# EasyEDA Pro project ProPrj_H750VB_2024-10-16.epro, board PCB2
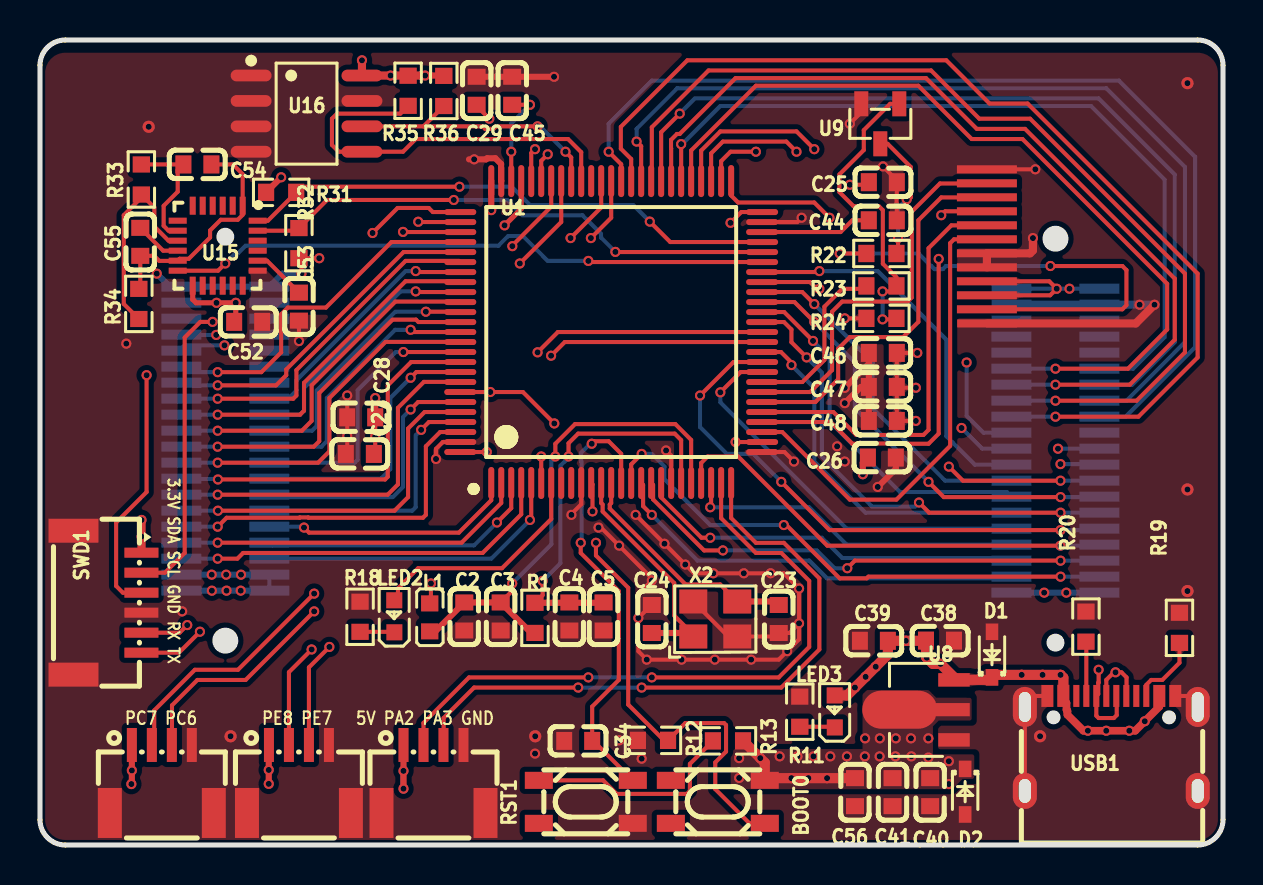
[diagram p4: board, top side]
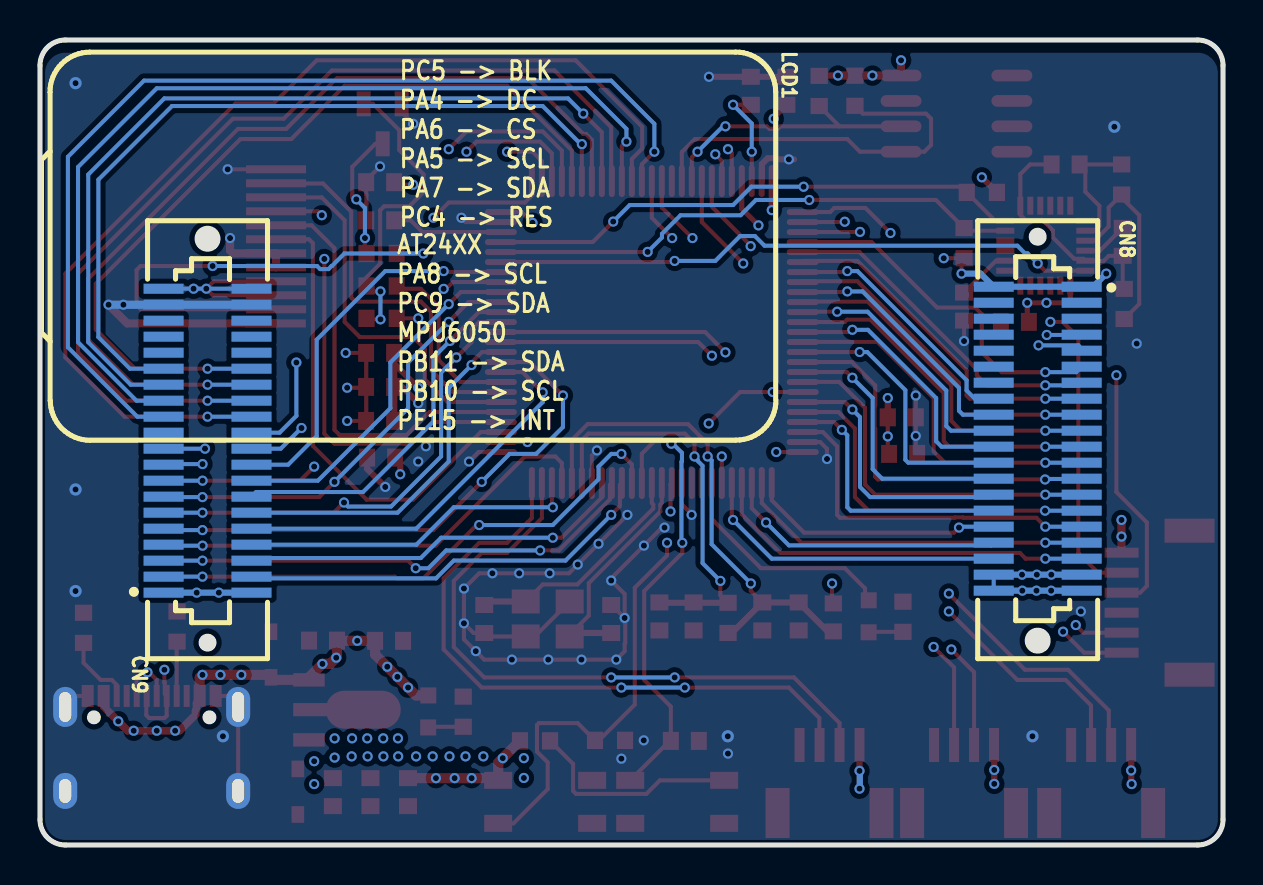
[diagram p5: board, bottom side, seen from below]

Outline 59.18 x 40.26 mm; copper layers: Top Layer, Inner1, 电源, Bottom Layer. Coordinates in mm from the lower left corner of the outline.
Outline path: 0,38.99 0,1.27 arc(0.37,0.37) 1.27,0 57.91,0 arc(58.81,0.37) 59.18,1.27 59.18,38.99 arc(58.81,39.89) 57.91,40.26 1.27,40.26 arc(0.37,39.89) 0,38.99
Stack: Top Layer 0.035mm 外层铜厚1oz / Dielectric1 0.2104mm 7628 RC49% 8.6mil / Inner1 0.0152mm 内层铜厚 / Dielectric2 1.065mm 1.1mm H/HOZ Copper / 电源 0.0152mm 内层铜厚 / Dielectric3 0.2104mm 7628 RC49% 8.6mil / Bottom Layer 0.035mm 外层铜厚1oz

## Design rules (mm)
net CAN_TX: OSC_OUT
net CAN_RX: OSC_OUT
template: 自定义配置
spacing copperThickness1oz (default): track to track 0.102, other pairs 0.152 to 0.3
spacing copperThickness2oz: track to track 0.203, other pairs 0.152 to 0.3
track width copperThickness1oz (default): min 0.127, default 0.254, max 2.54
track width copperThickness2oz: min 0.203, default 0.254, max 2.54
differential pair differentialPair (default): width min 0.127, default 0.254, max 2.54; gap min 0.152, default 0.152
via viaSize (default): diameter min 0.5, default 0.61, max 10; hole min 0.3, default 0.305, max 6.3
net 3.3V uses copperRegion1
net GND uses copperRegion1

## Placement (name value [footprint] x y rotation side)
BOOT0  TS-1145A-B-A  [SW-SMD_4P-L4.2-W3.2-P2.15-LS5.2]  33.91 2.16 90 top
C2  100nF  [C0603]  21.23 11.43 90 top
C3  100nF  [C0603]  23.05 11.43 90 top
C4  100nF  [C0603]  26.48 11.43 90 top
C5  100nF  [C0603]  28.19 11.43 90 top
C23  22pf  [C0603]  36.96 11.3 90 top
C24  22pf  [C0603]  30.61 11.3 270 top
C25  100nF  [C0603]  42.16 33.15 180 top
C26  100nF  [C0603]  42.12 19.38 180 top
C27  100nF  [C0603]  16 19.56 0 top
C28  100nF  [C0603]  16.07 21.39 0 top
C29  4.7uF  [C0603]  21.84 37.72 270 top
C34  100nF  [C0603]  26.92 5.21 0 top
C38  100nF  [C0603]  45.02 10.22 180 top
C39  100nF  [C0603]  41.72 10.21 0 top
C40  100nF  [C0603]  44.53 2.64 90 top
C41  10uF  [C0603]  42.65 2.64 90 top
C44  2.2uF  [C0603]  42.16 31.24 180 top
C45  2.2uF  [C0603]  23.62 37.72 270 top
C46  100nF  [C0603]  42.16 24.61 0 top
C47  100nF  [C0603]  42.16 22.91 0 top
C48  100nF  [C0603]  42.16 21.21 0 top
C52  100nF  [C0603]  10.41 26.16 180 top
C53  2.2nF  [C0603]  12.95 26.92 270 top
C54  100nF  [C0603]  7.87 34.04 0 top
C55  100nF  [C0603]  5.02 30.16 90 top
C56  100nF  [C0603]  40.77 2.64 90 top
CN8  X0802WVS-40AS-LPV01  [CONN-SMD_40P-P0.80_XKB_X0802WVS-40ADS-LPV01]  9.27 20.32 270 bottom
CN9  X0802WVS-40AS-LPV01  [CONN-SMD_40P-P0.80_XKB_X0802WVS-40ADS-LPV01]  50.8 20.22 90 bottom
D1  CESD5V0D3  [SOD-323_L1.7-W1.3-LS2.6-RD-2]  47.62 9.53 90 top
D2  CESD5V0D3  [SOD-323_L1.7-W1.3-LS2.6-RD-2]  46.28 2.67 270 top
L1  BLM18SG331TN1D-300Ω100MHz  [L0603]  19.5 11.38 270 top
LCD1  1.47寸 IPS 172*320  [1.47LCD-IPS-172*320-反面]  47.12 29.97 270 bottom
LED2  -  [LED_0603]  17.72 11.49 90 top
LED3  -  [LED_0603]  39.75 6.73 90 top
R1  0  [R0603]  24.76 11.36 270 top
R11  10K  [R0603]  38.01 6.67 270 top
R12  10K  [R0603]  30.67 5.23 0 top
R13  10K  [R0603]  34.42 5.21 0 top
R18  10K  [R0603]  16.01 11.41 270 top
R19  5.1k  [R0603]  57 10.86 90 top
R20  5.1k  [R0603]  52.32 10.92 270 top
R22  20  [R0603]  42.09 29.58 180 top
R23  1K  [R0603]  42.09 27.96 0 top
R24  10K  [R0603]  42.09 26.34 0 top
R31  5.1k  [R0603]  12.06 32.64 180 top
R32  5.1k  [R0603]  12.95 30.1 270 top
R33  5.1k  [R0603]  5.07 33.28 90 top
R34  5.1k  [R0603]  4.94 27.06 90 top
R35  5.1k  [R0603]  18.41 37.72 270 top
R36  5.1k  [R0603]  20.2 37.71 270 top
RST1  TS-1145A-B-A  [SW-SMD_4P-L4.2-W3.2-P2.15-LS5.2]  27.31 2.16 90 top
SWD1  swd  [CONN-SMD_6P-P1.00_MEGASTAR_ZX-SH1.0-6PWT]  3.38 12.12 270 top
U1  STM32H750VBT6  [LQFP-100_L14.0-W14.0-P0.50-LS16.0-BL]  28.57 25.65 0 top
U8  AMS1117-3.3  [SOT-89_L4.5-W2.5-P1.50-LS4.2-BR]  44.37 6.76 0 top
U9  SS8050  [SOT-23-3_L2.9-W1.3-P1.90-LS2.4-BR]  42.04 36.07 90 top
U15  MPU6050  [QFN-24_L4.0-W4.0-P0.50-BL]  8.89 29.97 180 top
U16  AT24C256C-SSHL-T  [SOIC-8_L4.9-W3.9-P1.27-LS6.0-BL]  13.34 36.58 270 top
USART2  WAFER-SH1.0-4PWB  [CONN-SMD_4P-P1.00_WAFER-SH1.0-4PWB]  19.69 3.3 0 top
USART3  WAFER-SH1.0-4PWB  [CONN-SMD_4P-P1.00_WAFER-SH1.0-4PWB]  12.95 3.3 0 top
USART7  WAFER-SH1.0-4PWB  [CONN-SMD_4P-P1.00_WAFER-SH1.0-4PWB]  6.1 3.3 0 top
USB1  TYPE-C 16PIN 2MD(073)  [USB-C-SMD_TYPE-C-6PIN-2MD-073]  53.59 5.08 0 top
X2  25MHz  [OSC-SMD_4P-L3.2-W2.5-BL]  33.78 11.3 0 top

## Footprints (pads in the part's own frame, mm; a bottom-side part is the same pattern mirrored in y, then rotated)
1.47LCD-IPS-172*320-反面
  rect 0.4x3 smd far side: 1(3.888,-0.266) 2(3.181,-0.254) 3(2.481,-0.254) 4(1.781,-0.254) 5(1.081,-0.254) 6(0.381,-0.254) 7(-0.319,-0.254) 8(-1.019,-0.254) 9(-1.719,-0.254) 10(-2.419,-0.254) 11(-3.119,-0.254) 12(-3.819,-0.254)
C0603
  rect 0.8x0.9 smd: 1(-0.7,0) 2(0.7,0)
CONN-SMD_4P-P1.00_WAFER-SH1.0-4PWB
  rect 0.5x1.7 smd: 1(-1.5,1.7) 2(-0.5,1.7) 3(0.5,1.7) 4(1.5,1.7)
  rect 1.2x2.5 smd: 5(-2.6,-1.7) 6(2.6,-1.7)
CONN-SMD_6P-P1.00_MEGASTAR_ZX-SH1.0-6PWT
  rect 0.5x1.7 smd: 1(-2.5,1.7) 2(-1.5,1.7) 3(-0.5,1.7) 4(0.5,1.7) 5(1.5,1.7) 6(2.5,1.7)
  rect 1.2x2.5 smd: 7(3.6,-1.7) 8(-3.6,-1.7)
CONN-SMD_40P-P0.80_XKB_X0802WVS-40ADS-LPV01
  rect 0.5x2 smd: 1(-7.6,2.2) 2(-7.6,-2.2) 3(-6.8,2.2) 4(-6.8,-2.2) 5(-6,2.2) 6(-6,-2.2) 7(-5.2,2.2) 8(-5.2,-2.2) 9(-4.4,2.2) 10(-4.4,-2.2) 11(-3.6,2.2) 12(-3.6,-2.2) 13(-2.8,2.2) 14(-2.8,-2.2) 15(-2,2.2) 16(-2,-2.2) 17(-1.2,2.2) 18(-1.2,-2.2) 19(-0.4,2.2) 20(-0.4,-2.2) 21(0.4,2.2) 22(0.4,-2.2) 23(1.2,2.2) 24(1.2,-2.2) 25(2,2.2) 26(2,-2.2) 27(2.8,2.2) 28(2.8,-2.2) 29(3.6,2.2) 30(3.6,-2.2) 31(4.4,2.2) 32(4.4,-2.2) 33(5.2,2.2) 34(5.2,-2.2) 35(6,2.2) 36(6,-2.2) 37(6.8,2.2) 38(6.8,-2.2) 39(7.6,2.2) 40(7.6,-2.2)
L0603
  rect 0.8x0.864 smd: 1(-0.7,0) 2(0.7,0)
LED_0603
  rect 0.8x0.8 smd: 1(-0.851,-0.01) 2(0.75,-0.005)
LQFP-100_L14.0-W14.0-P0.50-LS16.0-BL
  oval 0.3x1.6 smd: 1(-6,-7.55) 2(-5.5,-7.55) 3(-5,-7.55) 4(-4.5,-7.55) 5(-4,-7.55) 6(-3.5,-7.55) 7(-3,-7.55) 8(-2.5,-7.55) 9(-2,-7.55) 10(-1.5,-7.55) 11(-1,-7.55) 12(-0.5,-7.55) 13(0,-7.55) 14(0.5,-7.55) 15(1,-7.55) 16(1.5,-7.55) 17(2,-7.55) 18(2.5,-7.55) 19(3,-7.55) 20(3.5,-7.55) 21(4,-7.55) 22(4.5,-7.55) 23(5,-7.55) 24(5.5,-7.55) 25(6,-7.55) 51(6,7.55) 52(5.5,7.55) 53(5,7.55) 54(4.5,7.55) 55(4,7.55) 56(3.5,7.55) 57(3,7.55) 58(2.5,7.55) 59(2,7.55) 60(1.5,7.55) 61(1,7.55) 62(0.5,7.55) 63(0,7.55) 64(-0.5,7.55) 65(-1,7.55) 66(-1.5,7.55) 67(-2,7.55) 68(-2.5,7.55) 69(-3,7.55) 70(-3.5,7.55) 71(-4,7.55) 72(-4.5,7.55) 73(-5,7.55) 74(-5.5,7.55) 75(-6,7.55)
  oval 1.6x0.3 smd: 26(7.55,-6) 27(7.55,-5.5) 28(7.55,-5) 29(7.55,-4.5) 30(7.55,-4) 31(7.55,-3.5) 32(7.55,-3) 33(7.55,-2.5) 34(7.55,-2) 35(7.55,-1.5) 36(7.55,-1) 37(7.55,-0.5) 38(7.55,0) 39(7.55,0.5) 40(7.55,1) 41(7.55,1.5) 42(7.55,2) 43(7.55,2.5) 44(7.55,3) 45(7.55,3.5) 46(7.55,4) 47(7.55,4.5) 48(7.55,5) 49(7.55,5.5) 50(7.55,6) 76(-7.55,6) 77(-7.55,5.5) 78(-7.55,5) 79(-7.55,4.5) 80(-7.55,4) 81(-7.55,3.5) 82(-7.55,3) 83(-7.55,2.5) 84(-7.55,2) 85(-7.55,1.5) 86(-7.55,1) 87(-7.55,0.5) 88(-7.55,0) 89(-7.55,-0.5) 90(-7.55,-1) 91(-7.55,-1.5) 92(-7.55,-2) 93(-7.55,-2.5) 94(-7.55,-3) 95(-7.55,-3.5) 96(-7.55,-4) 97(-7.55,-4.5) 98(-7.55,-5) 99(-7.55,-5.5) 100(-7.55,-6)
OSC-SMD_4P-L3.2-W2.5-BL
  rect 1.4x1.2 smd: 1(-1.1,-0.875) 2(1.1,-0.875) 3(1.1,0.875) 4(-1.1,0.875)
QFN-24_L4.0-W4.0-P0.50-BL
  rect 0.3x0.9 smd: 1(-1.25,-2) 2(-0.75,-2) 3(-0.25,-2) 4(0.25,-2) 5(0.75,-2) 6(1.25,-2) 13(1.25,2) 14(0.75,2) 15(0.25,2) 16(-0.25,2) 17(-0.75,2) 18(-1.25,2)
  rect 0.9x0.3 smd: 7(2,-1.25) 8(2,-0.75) 9(2,-0.25) 10(2,0.25) 11(2,0.75) 12(2,1.25) 19(-2,1.25) 20(-2,0.75) 21(-2,0.25) 22(-2,-0.25) 23(-2,-0.75) 24(-2,-1.25)
R0603
  rect 0.806x0.864 smd: 1(-0.753,0) 2(0.753,0)
SOD-323_L1.7-W1.3-LS2.6-RD-2
  rect 0.83x0.63 smd: 1(-1.14,0) 2(1.14,0)
SOIC-8_L4.9-W3.9-P1.27-LS6.0-BL
  oval 0.588x2.045 smd: 1(-1.905,-2.772) 2(-0.635,-2.772) 3(0.635,-2.772) 4(1.905,-2.772) 5(1.905,2.772) 6(0.635,2.772) 7(-0.635,2.772) 8(-1.905,2.772)
SOT-23-3_L2.9-W1.3-P1.90-LS2.4-BR
  rect 1.25x0.7 smd: 1(1,-0.95) 2(1,0.95) 3(-1,0)
SOT-89_L4.5-W2.5-P1.50-LS4.2-BR
  rect 1.575x0.672 smd: 1(1.356,-1.5) 3(1.356,1.5)
  custom 5.377x1.9 smd: 2(-1.356,0.009)
SW-SMD_4P-L4.2-W3.2-P2.15-LS5.2
  rect 0.85x1.4 smd: 1(1.075,2.35) 2(1.075,-2.35) 3(-1.075,2.35) 4(-1.075,-2.35)
USB-C-SMD_TYPE-C-6PIN-2MD-073
  rect 0.6x1.1 smd: 1(-3.2,2.375) 2(-2.4,2.375) 11(2.4,2.375) 12(3.2,2.375)
  rect 0.3x1.1 smd: 3(-1.75,2.375) 4(-1.25,2.375) 5(-0.75,2.375) 6(-0.25,2.375) 7(0.25,2.375) 8(0.75,2.375) 9(1.25,2.375) 10(1.75,2.375)
  oval 1.2x2 hole 0.6x1.5: 13(-4.325,1.825) 14(4.325,1.825)
  oval 1.2x1.8 hole 0.6x1.2: 13(-4.325,-2.375) 14(4.325,-2.375)

## Nets
As in the schematic.

Pads without a net: BOOT0 1 3; RST1 3; U15 2 3 4 5 6 7 14 15 16 17 18 21 22; USB1 3 9

## Via types
v1: diameter 0.508, hole 0.305, Top Layer to Bottom Layer, 244 vias
v2: diameter 0.61, hole 0.305, Top Layer to Bottom Layer, 7 vias

## Routing (per net, layer and track width the routed paths; a pad name or vN(x,y) marks a point on that pad's centre or on a via; arc(x,y) is an arc through that point)
3.3V: length 67.5
  Top Layer w0.203: U1.11 27.64,18.04 v1(27.64,16.68) ; 47.37,28.19 50.49,28.19 v1(50.86,27.82) 50.53,27.49 47.37,27.49 ; U1.100 v1(22.35,19.65) ; v1(43.89,24.61) C46.2 C47.2 ; C29.2 21.84,36.96 v1(22.48,36.32) ; C47.2 42.91,22.87 v1(43.82,22.87) ; C47.2 C48.2 v1(43.81,21.21) ; v1(34.54,31.11) 35.08,31.65 U1.50 ; v1(13.08,28.58) 13.08,29.22 R32.2 v1(13.97,29.35) ; C27.2 16.77,19.63 v1(16.77,20.43) C28.2 ; v1(19.56,13.08) 19.56,12.15 L1.1 ; U1.27 v1(34.8,20.15) ; 41.46,33.02 v1(40.51,33.02) ; U1.6 v1(25.07,19.43) ; 20.38,38.48 20.06,38.48 ; R24.1 v1(40.26,26.34)
  Top Layer w0.254: U15.13 7.64,27.28 7.81,27.12 v1(8.83,27.12) v1(9.79,27.12) 9.79,26.24 C52.2
  Top Layer w0.305: v1(19.26,38.48) 20.38,38.48 ; C28.2 v1(16.77,22.35) ; 12.06,33.4 v1(12.06,33.39) R31.2 ; v1(41.16,18.54) 41.16,19.12 C26.2 ; U1.75 v1(22.57,31.75)
  Top Layer w0.406: v1(16.11,39.24) U16.8 v1(17.54,38.48) v1(19.26,38.48) ; v1(5.08,16.26) v1(5.08,15.42) 5.08,14.62 SWD1.1
  Top Layer w0.508: R13.2 v1(36.03,4.34) 36.26,4.12 BOOT0.2 36.37,3.34 v1(37.59,3.34) v1(38.44,3.34) v1(39.37,3.34) C56.2
  Bottom Layer w0.203: CN9.40 v1(50.86,27.82) v1(51.5,27.82) CN9.39
  Bottom Layer w0.305: v1(13.08,28.58) 12.13,28.58 11.47,27.92 6.5,27.92 v1(5.84,28.58) ; CN9.2 v1(50.24,12.62) v1(51.34,12.62) CN9.1
  vias: v1(34.98,4.34) v1(34.98,3.35) v1(37,4.43) v1(37.9,4.43) v1(38.7,4.43) v1(39.54,4.43) v1(40.37,4.43) v1(41.28,5.33) v1(41.26,4.43) v1(42.01,5.33) v1(42,4.43) v1(42.81,5.33) v1(42.79,4.43) v1(43.57,5.33) v1(43.59,4.43) v1(44.44,5.33) v1(44.44,4.37) v1(45.47,4.19) v1(45.47,3.05)
+5V: length 40.4
  Top Layer w0.305: 11.44,4.88 v1(11.44,3.75) v1(11.44,3.06) ; 18.16,2.79 v1(18.19,2.82) v1(18.19,3.71) USART2.1 ; USART7.1 v1(4.6,3.73) 4.6,3.07 v1(4.57,3.05)
  Top Layer w0.381: USB1.2 51.19,7.26 51.35,7.1 51.35,6.76 51.39,6.72 51.39,6.67 51.4,6.67 51.4,6.52 52.2,5.72 v1(52.42,5.72) v1(53.34,5.72) v1(54.49,5.72) 54.79,5.72 v1(55.27,6.19) 55.99,6.92 USB1.11
  Top Layer w0.508: LED3.2 40.37,7.48 v1(40.77,7.87) v1(41.3,8.41) v1(41.81,8.92) 42.42,9.52 C39.2 v1(43.31,10.21) 44.31,10.21 C38.2 44.32,9.41 v1(44.36,9.37) 44.67,9.06 v1(45.05,9.06) 45.72,8.39 U8.3 47.5,8.26 D1.1 47.75,8.51 v1(49.11,8.51) v1(50.16,8.51) v1(51.05,8.51) 51.19,8.37 USB1.2
  Inner1 w0.305: 18.16,4.44 18.16,2.79
  Bottom Layer w0.203: 11.47,12.72 11.47,13.52
  Bottom Layer w0.305: 11.47,12.72 v1(10.04,12.72) v1(9.33,12.72) v1(8.6,12.72) 7.07,12.72 ; 7.07,13.52 v1(8.59,13.52) v1(9.31,13.52) v1(10.06,13.52) 11.47,13.52 ; 18.17,2.85 18.17,3.55
GND: length 119.4
  Top Layer w0.203: U1.49 37.88,31.15 v1(38.1,31.37) ; v1(27.94,15.88) 28.07,15.88 v1(28.97,14.97) 30.61,13.33 v1(30.61,13.23) 29.94,12.56 v1(29.94,11.36) ; v1(15.37,22.48) C28.1 v1(15.37,20.46) 15.37,19.63 C27.1 ; U1.19 31.57,19.48 v1(31.32,19.73) ; USB1.12 57.37,7.45 57.92,6.91 ; U1.99 20.15,20.15 19.81,19.81 v1(19.81,19.3) ; U9.2 41.09,36.64 v1(40.51,36.07) ; v1(12.96,25.2) 12.95,25.2 C53.2 ; C44.1 42.86,32.07 42.85,32.08 42.85,32.5 42.86,32.51 42.86,33.14 C25.1 42.86,33.24 v1(42.17,33.94) ; 47.37,33.79 v1(49.79,33.79) ; v1(37.97,11.09) v1(37.97,12.83) 37.21,13.59 v1(36.55,13.59) v1(35.21,13.59) v1(33.68,13.59) 32.72,13.59 v1(32.28,14.03) v1(31.24,15.07) v1(29.8,16.51) ; v1(37.97,11.09) 37.49,10.6 C23.1 36.78,10.43 X2.2 34.43,10.43 X2.4 ; v1(37.97,11.09) 37.97,10.29 v1(37.38,9.69) 36.96,9.27 v1(35.57,9.27) v1(33.76,9.27) v1(32.09,9.27) v1(30.35,9.27) 29.94,9.69 29.94,10.07 29.9,10.1 29.9,11.11 29.94,11.14 v1(29.94,11.36) ; v1(29.94,11.36) 30.58,12 C24.1 ; v1(26.59,16.51) 26.59,16.55 27.07,17.04 U1.10 ; v1(37.72,19.18) 37.24,19.65 U1.26 ; USB1.1 49.82,7.45 USB1.13 USB1.13
  Top Layer w0.305: C48.1 C47.1 ; C47.1 41.07,22.91 v1(40.26,22.1) ; C47.1 41.46,24.06 ; 41.46,24.06 C46.1 ; 41.46,24.06 v1(40.26,22.86) ; U1.74 23.07,33.21 23.07,34.06 22.78,34.35 22.37,34.35 22.31,34.29 v1(21.72,34.29) 21.46,34.29 ; C29.1 C45.1 v1(25.72,38.42) 25.78,38.35 ; v1(41.91,17.91) 42.82,18.81 C26.1
  Top Layer w0.406: v1(49.67,30.35) 49.67,29.73 49.53,29.59 47.37,29.59 47.37,28.89 ; 47.38,26.08 54.82,26.08 v1(55.75,27.02)
  Inner1 w0.203: v1(4.32,25.08) 8.42,25.08 9.02,24.48 11.07,24.48 11.79,25.2 v1(12.96,25.2) ; 15.37,19.69 15.37,17.27 10.31,12.21 7.89,12.21 7.37,11.68 v1(7.11,11.68)
  Bottom Layer w0.406: v1(55.75,27.02) v1(55.01,27.02) CN9.37 CN9.38
  vias: v1(24.76,4.57) v1(28.98,5.23) v1(30.1,4.32) v1(39.88,19.94) v1(40.26,19.18) v2(5.44,35.92) v2(9.53,5.44) v2(24.77,5.44) v2(50.03,5.44) v2(57.4,38.1) v2(57.4,17.78) v2(57.4,12.7)
VDDA: length 25.2
  Top Layer w0.203: C3.2 23.62,12.71 v1(23.62,13.08) ; U1.21 32.57,20.26 31.78,21.05 26.76,21.05 25.78,20.07 v1(25.78,19.43)
  Top Layer w0.305: L1.2 19.78,10.68 C2.2 C3.2 24.57,10.61 R1.2
  Bottom Layer w0.203: v1(23.62,13.08) 25.58,15.04 25.58,19.23 v1(25.78,19.43)
485_UART4_RX: length 16.9
  Top Layer w0.203: U1.23 33.57,17.02
  Bottom Layer w0.203: v1(33.53,16.89) 38.48,16.89 40.35,15.02 CN9.8
485_UART4_TX: length 22.9
  Top Layer w0.203: v1(51.05,14.97) 39.39,14.97 34.93,19.43 33.4,19.43 33.07,19.11 U1.22
  Bottom Layer w0.203: v1(51.05,14.97) 52.95,14.97 CN9.7
BLK: length 8.8
  Top Layer w0.203: U1.33 38.14,23.15 39.24,24.26 39.24,26.92 40.13,27.81 41.19,27.81 R23.1
BOOT0: length 33.6
  Top Layer w0.203: U1.94 v1(22.53,22.65) 24.16,22.65 v1(25.73,21.08) ; v1(27.81,15.11) 27.81,14.48 29.43,12.86 29.43,7.02 31.22,5.23 31.42,5.23 32.28,6.1 34.22,6.1 34.32,6 34.32,4.67 33.78,4.13 33.78,2.79 35.49,1.08 BOOT0.4
  Inner1 w0.203: v1(27.81,15.11) 27.13,15.79 27.13,19.73 25.78,21.08 v1(25.73,21.08)
CAN_RX: length 52
  Top Layer w0.203: v1(52.96,8.76) 52.96,8.13 52.94,8.11 52.94,7.55 USB1.5 52.84,6.47 52.96,6.35 53.72,6.35 53.86,6.49 53.86,7.43 USB1.7 ; U1.70 25.07,34.22 v1(25.4,34.54)
  Inner1 w0.203: v1(52.96,8.76) 53.2,9.01 53.2,9.21 50.66,11.76 49.88,11.76 49.37,12.26 49.37,13.04 46.54,15.88 45.07,15.88 arc(44.95,15.83) 44.9,15.71 arc(44.75,15.34) 44.38,15.19 43.19,15.19 arc(42.82,15.34) 42.67,15.71 arc(42.62,15.83) 42.5,15.88 40.87,15.88 39.73,17.02 35.54,17.02 29.34,23.22 29.34,30.86 26.92,33.27 26.92,34.92 26.67,35.18 26.08,35.18 25.44,34.54 v1(25.4,34.54)
CAN_TX: length 52.2
  Top Layer w0.203: v1(24.76,34.8) 24.57,34.61 U1.71 ; USB1.6 53.34,8.26 53.72,8.64 v1(53.81,8.64) 54.1,8.64 54.36,8.38 54.36,7.89 54.34,7.88 USB1.8
  Inner1 w0.203: v1(24.76,34.8) 25.53,35.56 26.79,35.56 27.28,35.07 27.28,33.42 29.69,31.01 29.69,23.37 35.69,17.37 39.88,17.37 41.02,16.23 42.5,16.23 arc(42.87,16.08) 43.02,15.71 arc(43.07,15.59) 43.19,15.54 44.38,15.54 arc(44.5,15.59) 44.55,15.71 arc(44.7,16.08) 45.07,16.23 46.69,16.23 49.73,13.19 49.73,12.41 50.02,12.11 50.81,12.11 53.56,9.36 53.56,8.88 v1(53.81,8.64)
CS: length 21.4
  Top Layer w0.203: 47.37,30.99 47.37,30.99 45.59,30.99 44.45,29.85 44.45,20.76 44.19,20.51 40.84,20.51 39.69,21.65 U1.30
DC: length 24
  Top Layer w0.203: 47.37,30.29 45.72,30.29 45.53,30.1 45.53,19.96 42.84,17.27 40.51,17.27 37.13,20.65 U1.28
LEDK: length 25
  Top Layer w0.203: R22.2 v1(40,29.58) ; 47.37,26.79 54.15,26.79 54.35,26.99 54.35,28.75 54.15,28.96 v1(50.55,28.96)
  Bottom Layer w0.203: v1(40,29.58) 43.95,29.58 44.58,28.96 44.59,28.96 44.75,28.8 45.17,28.8 45.32,28.96 v1(50.55,28.96)
LPUART1_RX: length 33.8
  Top Layer w0.203: v1(7.37,11) 6.99,10.62 SWD1.5 ; 23.62,29.97 25.57,31.92 U1.69
  Inner1 w0.203: 23.62,29.97 21.34,27.69 21.34,22.31 10.71,11.68 8.05,11.68 v1(7.37,11)
  vias: v1(23.63,29.95)
LPUART1_TX: length 34.7
  Top Layer w0.203: v1(24,29.08) 26.07,31.16 U1.68 ; SWD1.6 6.95,9.62 v1(8,10.67)
  Inner1 w0.203: v1(24,29.08) 21.9,26.97 21.9,22.28 10.92,11.3 8.64,11.3 v1(8,10.67)
OSC_IN: length 11.6
  Top Layer w0.203: 32.58,10.53 32.58,10.62 31.73,11.47 31.73,13.1 28.15,16.68 28.15,17.03 28.07,17.1 U1.12
  Top Layer w0.305: X2.1 32.51,10.6 C24.2
OSC_OUT: length 11.8
  Top Layer w0.203: X2.3 34.03,13.03 32.3,13.03 28.5,16.83 28.5,17.03 28.57,17.1 U1.13
  Top Layer w0.305: X2.3 36.78,12.18 C23.2
PA2: length 32.7
  Top Layer w0.203: v1(27.43,8.38) 21.46,8.38 19.19,6.1 USART2.2 ; v1(30.61,8.38) 36.96,8.38 38.48,9.91 38.48,13.21 37.08,14.61 35.81,14.61 34.07,16.34 U1.24
  Bottom Layer w0.203: v1(27.43,8.38) v1(30.61,8.38)
PA3: length 32.5
  Top Layer w0.203: v1(26.92,7.87) 21.72,7.87 20.19,6.35 20.19,5.01 USART2.3 ; v1(30.1,7.87) 37.08,7.87 38.99,9.78 38.99,13.33 37.21,15.11 35.81,15.11 34.57,16.35 U1.25
  Bottom Layer w0.203: v1(26.92,7.87) v1(30.1,7.87)
PA5: length 22.8
  Top Layer w0.203: U1.29 39.55,21.15 40.64,20.07 40.9,20.07 40.91,20.08 43.32,20.08 43.33,20.07 44.45,20.07 44.96,20.57 v1(44.96,29.31) ; 47.37,31.69 45.28,31.69 v1(45.09,31.5)
  Inner1 w0.203: v1(45.09,31.5) 44.96,31.37 v1(44.96,29.31)
PA7: length 19.4
  Top Layer w0.203: 47.37,32.39 47.37,32.39 45.09,32.39 43.94,31.24 43.94,26.16 43.18,25.4 40.51,25.4 39.93,24.82 39.93,23.29 38.79,22.15 U1.31
PA8: length 13.8
  Top Layer w0.203: U1.67 26.57,34.39 v1(26.29,34.67) ; 19.19,35.94 R36.2 ; 19.19,35.94 22.14,35.94 22.27,35.81 22.69,35.81 22.82,35.94 v1(24.89,35.94) ; 19.19,35.94 16.11,35.94
  Bottom Layer w0.203: v1(24.89,35.94) 25.02,35.94 v1(26.29,34.67)
PA13: length 36.4
  Top Layer w0.203: SWD1.3 4.14,12.62 3.81,12.95 3.81,16.13 5.33,17.65 v1(5.33,23.5)
  Top Layer w0.254: U1.72 24.07,31.82 v1(23.24,30.99)
  Inner1 w0.203: v1(23.24,30.99) 19.56,30.99 12.72,24.15 5.61,24.15 5.33,23.88 v1(5.33,23.5)
PA14: length 29.9
  Top Layer w0.203: U1.76 19.65,31.65 19.45,31.86 17.89,31.86 v1(16.64,30.61) ; SWD1.2 6.25,13.62 7.24,14.61 7.24,25.38 8.02,26.16 v1(8.64,26.16)
  Inner1 w0.203: v1(16.64,30.61) 13.84,27.81 12.32,27.81 10.67,26.16 v1(8.64,26.16)
PA15: length 16.4
  Top Layer w0.203: U1.77 18.94,31.15 v1(18.92,31.17)
  Inner1 w0.203: v1(8.82,25.51) 10.65,25.51 12.45,27.31 14.1,27.31 17.65,30.86 17.65,30.87 17.95,31.17 v1(18.92,31.17)
  Bottom Layer w0.203: v1(8.82,25.51) 7.03,25.51 7.02,25.53
PB0: length 20.2
  Top Layer w0.203: U1.34 35.05,23.65 v1(34.04,22.64)
  Bottom Layer w0.203: v1(34.04,22.64) 34.04,22.14 40.36,15.82 CN9.10
PB1: length 27.5
  Top Layer w0.203: U1.35 34.69,24.15 v1(33.02,22.48) ; v1(37.08,18.16) 39.5,15.75 v1(51.05,15.75)
  Bottom Layer w0.203: v1(51.05,15.75) 52.93,15.75 CN9.9 ; v1(37.08,18.16) 35.69,19.56 34.36,19.56 33.02,20.9 v1(33.02,22.48)
PB2: length 17.9
  Top Layer w0.203: 37.59,24.13 37.07,24.65 U1.36
  Bottom Layer w0.203: v1(37.59,24) 38.74,22.86 38.74,19.18 41.29,16.62 CN9.12
PB3: length 18
  Top Layer w0.203: v1(8.89,19.12) 13.91,19.12 14.48,19.69 14.48,22.35 17.29,25.16 21.02,25.16 U1.89
  Bottom Layer w0.203: 7.07,19.12 v1(8.89,19.12)
PB4: length 13.9
  Top Layer w0.203: U1.90 v1(18.18,24.65)
  Bottom Layer w0.203: v1(18.18,24.65) 17.8,24.65 15.89,22.75 15.89,19.26 15.75,19.12 11.47,19.12
PB5: length 19
  Top Layer w0.203: v1(8.9,18.28) 17.26,18.28 17.4,18.42 17.4,20.81 17.42,20.83 17.42,21.94 17.4,21.97 17.4,22.99 18.57,24.15 U1.91
  Bottom Layer w0.203: 8.79,18.32 8.78,18.31 7.09,18.31 7.07,18.32
PB6: length 13.8
  Top Layer w0.203: U1.92 18.83,23.65 v1(18.54,23.37)
  Bottom Layer w0.203: v1(18.54,23.37) 17.53,22.35 17.53,18.8 17.05,18.32 11.47,18.32
PB7: length 18.5
  Top Layer w0.203: U1.93 21.02,23.16 19.21,23.16 17.91,21.86 17.91,18.03 17.39,17.52 v1(8.89,17.52)
  Bottom Layer w0.203: 7.07,17.52 v1(8.89,17.52)
PB8: length 13.6
  Top Layer w0.203: U1.95 18.92,22.15 v1(18.54,21.78)
  Bottom Layer w0.203: 11.47,17.52 11.59,17.4 17.65,17.4 18.16,17.91 18.16,21.4 v1(18.54,21.78)
PB9: length 18
  Top Layer w0.203: U1.96 19.24,21.65 18.41,20.83 18.41,17.4 17.74,16.72 v1(8.9,16.72)
  Bottom Layer w0.203: 7.07,16.72 v1(8.9,16.72)
PB10: length 27.1
  Top Layer w0.203: v1(20.7,32.26) 14.36,32.26 R32.1 12.82,30.72 U15.23 ; U1.46 28.79,29.65 v1(28.78,29.66)
  Bottom Layer w0.203: v1(28.78,29.66) 28.07,30.38 28.07,30.56 27.13,31.5 24.13,31.5 23.37,32.26 v1(20.7,32.26)
PB11: length 27.1
  Top Layer w0.203: v1(30.51,31.18) 31.53,30.15 U1.47 ; U15.24 11.4,31.22 R31.1 13.1,32.92 v1(20.98,32.92)
  Bottom Layer w0.203: v1(20.98,32.92) 23.59,32.92 24.51,32 29.68,32 v1(30.51,31.18)
PB12: length 27.6
  Top Layer w0.203: v1(39.5,31.37) 38.74,32.13 34.93,32.13 34.57,32.48 U1.51
  Inner1 w0.203: v1(39.5,31.37) 44.58,26.29 44.58,21.34 46.86,19.05 v1(51.05,19.05)
  Bottom Layer w0.203: v1(51.05,19.05) 52.97,19.05 CN9.17
PB13: length 24.7
  Top Layer w0.203: U1.52 34.07,34.2 34.54,34.67 v1(35.81,34.67)
  Inner1 w0.203: 35.69,34.67 36.96,34.67 45.09,26.54 45.09,21.87 v1(46.1,20.86)
  Bottom Layer w0.203: CN9.20 47.14,19.82 v1(46.1,20.86)
PB14: length 30.4
  Top Layer w0.203: U1.53 33.57,34.59 34.16,35.18 37.34,35.18 v1(37.85,34.67)
  Inner1 w0.203: v1(37.85,34.67) 45.59,26.92 45.59,22.35 47.35,20.59 47.35,20.08 47.62,19.82 v1(50.93,19.82)
  Bottom Layer w0.203: CN9.19 v1(50.93,19.82)
PB15: length 31.1
  Top Layer w0.203: v1(38.74,34.8) 37.85,35.69 34.04,35.69 33.07,34.73 U1.54
  Inner1 w0.203: v1(38.74,34.8) 45.72,34.8 46.35,34.16 v1(46.35,24.13)
  Bottom Layer w0.203: CN9.22 47.2,20.62 46.35,21.46 v1(46.35,24.13)
PC0: length 27.6
  Top Layer w0.203: v1(37.21,16) 37.34,16 40,13.34 41.36,13.34 41.44,13.42 v1(51.05,13.42) ; v1(30.1,19.56) 29.57,19.03 U1.15
  Bottom Layer w0.203: CN9.3 v1(51.05,13.42) ; v1(30.1,19.56) 30.61,19.56 31.24,18.92 31.24,18.29 33.53,16 v1(37.21,16)
PC1: length 21.2
  Top Layer w0.203: U1.16 30.17,18.01 30.17,16.95 v1(30.61,16.51)
  Bottom Layer w0.203: CN9.4 48.51,13.33 39.37,13.33 38.48,14.22 32.89,14.22 v1(30.61,16.51)
PC2: length 24.8
  Top Layer w0.203: v1(40.39,13.84) 40.77,14.22 51.05,14.22 v1(51.05,14.22) ; v1(34.16,14.73) 33.22,14.73 30.67,17.28 30.67,18.01 U1.17
  Bottom Layer w0.203: v1(40.39,13.84) 39.75,13.84 38.86,14.73 v1(34.16,14.73) ; CN9.5 v1(51.05,14.22)
PC3: length 19.6
  Top Layer w0.203: U1.18 31.07,17.38 33.09,15.37 v1(33.53,15.37)
  Bottom Layer w0.203: v1(33.53,15.37) 39.12,15.37 40.13,14.35 48.47,14.35 CN9.6
PC4: length 19.8
  Top Layer w0.203: U1.32 38.53,22.65 39.62,23.75 39.62,26.67 40.13,27.18 43.41,27.18 43.61,27.38 43.61,31.67 45.02,33.08 47.36,33.08 47.37,33.09
PC6: length 38.7
  Top Layer w0.203: U1.63 28.57,31.37 v1(27.56,30.35) ; USART7.3 6.6,5.01 6.6,6.98 7.87,8.25 10.29,8.25 v1(13.72,11.68)
  Inner1 w0.203: v1(13.72,11.68) 13.72,11.74 23.88,21.9 23.88,26.67 v1(27.56,30.35)
PC7: length 38.9
  Top Layer w0.203: USART7.2 5.72,5.12 5.72,6.73 7.75,8.76 9.91,8.76 v1(13.72,12.57) ; v1(26.54,30.35) 28.07,31.89 U1.64
  Inner1 w0.203: v1(26.54,30.35) 23.37,27.18 23.37,21.97 13.97,12.57 v1(13.72,12.57)
PC9: length 20
  Top Layer w0.203: U1.66 27.07,34.65 26.42,35.31 18.8,35.31 18.16,34.67 U16.5 14.94,34.67 14.6,35.01 14.6,36.32 14.86,36.58 18.03,36.58 R35.2
PC10: length 16.7
  Top Layer w0.203: v1(18.16,30.66) 18.17,30.65 U1.78
  Inner1 w0.203: v1(9.23,24.99) 11.15,24.99 12.06,25.91 12.06,26.29 12.7,26.92 14.35,26.92 18.09,30.66 v1(18.16,30.66)
  Bottom Layer w0.203: 7.02,24.77 7.24,24.99 v1(9.23,24.99)
PC11: length 17.9
  Top Layer w0.203: v1(8.89,23.65) 11.07,23.65 12.06,24.64 12.06,26.54 12.4,26.88 14.3,26.88 17.58,30.15 U1.79
  Bottom Layer w0.203: v1(8.89,23.65) 7.34,23.65 7.07,23.92
PC12: length 16.9
  Top Layer w0.203: v1(8.89,22.99) 11.81,22.99 12.32,23.5 12.32,23.78 18.19,29.65 U1.80
  Bottom Layer w0.203: 7.07,23.12 7.2,22.99 v1(8.89,22.99)
PC13: length 11.6
  Top Layer w0.203: U1.7 25.57,16.3 23.11,13.84 18.92,13.84 17.91,12.83 17.91,12.42 17.72,12.24
PD0: length 17.4
  Top Layer w0.203: v1(8.89,22.32) 12.67,22.32 12.83,22.48 12.83,23.75 18.29,29.21 20.97,29.21 U1.81
  Bottom Layer w0.203: 7.07,22.32 8.76,22.32
PD1: length 12.5
  Top Layer w0.203: v1(18.8,28.7) 18.84,28.65 U1.82
  Bottom Layer w0.203: v1(18.8,28.7) 18.29,28.7 12.83,23.24 12.83,22.73 12.41,22.32 11.47,22.32
PD2: length 17.6
  Top Layer w0.203: U1.83 20.99,28.19 18.29,28.19 13.21,23.11 13.21,21.72 13.01,21.52 v1(8.89,21.52)
  Bottom Layer w0.203: 7.07,21.52 v1(8.89,21.52)
PD3: length 12.8
  Top Layer w0.203: U1.84 18.83,27.65 v1(18.8,27.69)
  Bottom Layer w0.203: 11.47,21.52 13.01,21.52 13.21,21.72 13.21,22.86 18.03,27.69 v1(18.8,27.69)
PD4: length 17.7
  Top Layer w0.203: v1(8.89,20.72) 13.1,20.72 13.59,21.21 13.59,22.99 17.78,27.18 21,27.18 U1.85
  Bottom Layer w0.203: 7.07,20.72 v1(8.89,20.72)
PD5: length 13.1
  Top Layer w0.203: U1.86 21.01,26.67 v1(19.3,26.67)
  Bottom Layer w0.203: v1(19.3,26.67) 17.78,26.67 13.84,22.73 13.84,20.95 13.61,20.72 11.47,20.72
PD6: length 18
  Top Layer w0.203: U1.87 18.93,26.15 18.81,26.27 17.64,26.27 13.97,22.61 13.97,20.19 13.7,19.92 v1(8.89,19.92)
  Bottom Layer w0.203: 7.07,19.92 v1(8.89,19.92)
PD7: length 13.3
  Top Layer w0.203: U1.88 18.65,25.65 v1(18.54,25.77)
  Bottom Layer w0.203: v1(18.54,25.77) 17.76,25.77 14.35,22.35 14.35,20.19 14.08,19.92 11.47,19.92
PD8: length 41.7
  Top Layer w0.203: v1(50.8,23.82) 54.43,23.82 56.39,25.78 56.39,28.07 49.15,35.31 46.61,35.31 43.94,37.97 35.81,37.97 32.57,34.73 U1.55
  Bottom Layer w0.203: CN9.30 v1(50.8,23.82)
PD9: length 40.3
  Top Layer w0.203: U1.56 v1(32.07,35.05)
  Bottom Layer w0.203: CN9.29 54.68,23.82 56.26,25.4 56.26,33.27 52.58,36.96 34.04,36.96 32,34.92
PD10: length 44.8
  Top Layer w0.203: v1(50.8,23.02) 54.52,23.02 56.77,25.27 56.77,28.32 49.28,35.81 46.86,35.81 44.32,38.35 34.8,38.35 32,35.56 31.87,35.56 31.57,35.26 31.57,34.84 31.57,34.83 U1.57
  Bottom Layer w0.203: CN9.28 v1(50.8,23.02)
PD11: length 43.4
  Top Layer w0.203: U1.58 31.07,35.65 v1(32,36.58)
  Bottom Layer w0.203: v1(32,36.58) 32.77,37.34 52.96,37.34 56.77,33.53 56.77,25.15 54.64,23.02 CN9.27
PD12: length 48.4
  Top Layer w0.203: v1(50.8,22.22) 54.86,22.22 57.28,24.64 57.28,28.58 49.53,36.32 46.99,36.32 44.58,38.73 33.44,38.73 30.61,35.9 30.61,33.24 U1.59
  Bottom Layer w0.203: CN9.26 v1(50.8,22.22)
PD13: length 46.9
  Top Layer w0.203: U1.60 30.07,34.95 v1(29.84,35.18)
  Bottom Layer w0.203: v1(29.84,35.18) 29.84,35.81 31.88,37.85 53.34,37.85 57.28,33.91 57.28,25.15 54.35,22.22 CN9.25
PD14: length 52.3
  Top Layer w0.203: U1.61 29.57,34.31 29.06,34.82 29.06,35.92 32.38,39.24 45.34,39.24 47.5,37.08 49.4,37.08 57.91,28.58 57.91,24.38 54.95,21.42 v1(50.8,21.42)
  Bottom Layer w0.203: CN9.24 v1(50.8,21.42)
PD15: length 50.7
  Top Layer w0.203: v1(28.45,34.67) 29.07,34.04 U1.62
  Bottom Layer w0.203: v1(28.45,34.67) 28.45,36.07 30.61,38.23 53.97,38.23 57.78,34.42 57.78,24.89 54.31,21.42 CN9.23
PE0: length 13.5
  Top Layer w0.203: v1(19.07,20.76) 19.46,21.15 U1.97
  Bottom Layer w0.203: 11.47,16.72 18.62,16.72 18.8,16.89 18.8,20.49 v1(19.07,20.76)
PE1: length 17.9
  Top Layer w0.203: U1.98 20.02,20.65 19.3,19.94 19.3,16.51 19.16,16.37 13.43,16.37 13.42,16.38 13,16.38 12.98,16.37 9.34,16.37 v1(8.89,15.92)
  Bottom Layer w0.203: 7.07,15.92 v1(8.89,15.92)
PE2: length 12.8
  Top Layer w0.203: v1(13.21,15.88) 13.46,15.62 20.96,15.62 22.57,17.24 U1.1
  Bottom Layer w0.203: v1(13.21,15.88) 13.16,15.92 11.47,15.92
PE3: length 17.8
  Top Layer w0.203: v1(8.89,15.12) 21.09,15.12 23.07,17.11 U1.2
  Bottom Layer w0.203: 7.07,15.12 v1(8.89,15.12)
PE4: length 14.2
  Top Layer w0.203: v1(22.86,16.13) 23.57,16.84 U1.3
  Bottom Layer w0.203: 11.47,15.12 11.6,14.99 21.72,14.99 v1(22.86,16.13)
PE5: length 19.5
  Top Layer w0.203: U1.4 24.07,16.54 22.14,14.61 10.16,14.61 9.88,14.32 v1(8.89,14.32)
  Bottom Layer w0.203: 7.07,14.32 v1(8.89,14.32)
PE6: length 15.7
  Top Layer w0.203: U1.5 24.57,16.32 v1(24.51,16.26)
  Bottom Layer w0.203: v1(24.51,16.26) 22.57,14.32 11.47,14.32
PE7: length 35.3
  Top Layer w0.203: v1(25.57,24.47) 26.25,25.15 U1.37 ; USART3.3 13.45,8.88 v1(14.48,9.91)
  Inner1 w0.203: v1(25.57,24.47) 24.76,23.67 24.76,20.19 v1(14.48,9.91)
PE8: length 36.4
  Top Layer w0.203: v1(24.89,24.64) 25.91,25.65 U1.38 ; v1(13.59,9.78) 12.45,8.64 USART3.2
  Inner1 w0.203: v1(24.89,24.64) 24.38,24.13 24.38,20.7 13.59,9.91 v1(13.59,9.78)
PE9: length 23.8
  Top Layer w0.203: v1(51.05,16.62) 44.48,16.62 v1(43.97,17.13) ; U1.39 37.22,26.15 37.59,25.78 37.59,25.15 v1(38.35,24.38)
  Bottom Layer w0.203: v1(43.97,17.13) 43.77,16.92 41.62,16.92 39.12,19.43 39.12,23.62 v1(38.35,24.38) ; CN9.11 v1(51.05,16.62)
PE10: length 18.2
  Top Layer w0.203: U1.40 37.23,26.65 v1(38.67,25.21)
  Bottom Layer w0.203: CN9.14 48.37,17.65 43.02,17.65 39.5,21.18 39.5,24.38 v1(38.67,25.21)
PE11: length 22.3
  Top Layer w0.203: U1.41 37.74,27.15 v1(38.74,26.16) ; v1(44.45,18.16) 45.21,17.4 v1(51.05,17.4)
  Bottom Layer w0.203: v1(51.05,17.4) 52.98,17.4 CN9.13 ; v1(44.45,18.16) 40.77,21.84 40.77,24.13 v1(38.74,26.16)
PE12: length 17.7
  Top Layer w0.203: U1.42 38.13,27.65 v1(38.74,27.05)
  Bottom Layer w0.203: v1(38.74,27.05) 41.66,24.13 41.66,21.84 45.28,18.22 CN9.16
PE13: length 22.1
  Top Layer w0.203: v1(45.47,18.92) 46.17,18.22 v1(51.05,18.22) ; 38.74,27.94 38.52,28.15 U1.43
  Inner1 w0.203: v1(38.99,27.81) 39.62,27.18 39.62,24.77 43.31,21.08 43.31,21 43.6,20.7 43.69,20.7 v1(45.47,18.92)
  Bottom Layer w0.203: CN9.15 51.05,18.22
PE14: length 19.3
  Top Layer w0.203: v1(38.99,28.7) 38.94,28.65 U1.44
  Bottom Layer w0.203: CN9.18 46.77,19.02 45.34,20.45 45.34,25.27 41.91,28.7 v1(38.99,28.7)
PE15: length 30.5
  Top Layer w0.203: U15.12 8.91,28.72 v1(9.27,29.08) ; U1.45 27.49,29.15 v1(27.43,29.21)
  Bottom Layer w0.203: v1(9.27,29.08) 9.78,29.59 9.91,29.59 10.29,29.97 22.94,29.97 23.42,30.46 24.15,30.46 25.4,29.21 v1(27.43,29.21)
RST: length 22.6
  Top Layer w0.203: v1(27.6,20.07) 27.73,20.19 28.45,20.19 29.07,19.57 U1.14 ; v1(27.05,15.11) 27.05,14.61 28.96,12.7 28.96,8.25 27.62,6.92 C34.2 27.68,5.21 RST1.2
  Bottom Layer w0.203: v1(27.05,15.11) 27.09,15.15 27.09,19.17 27.07,19.19 27.07,19.61 27.52,20.07 v1(27.6,20.07)
VREF: length 20.3
  Top Layer w0.203: v1(26.44,19.43) 26.44,20.09 26.92,20.57 31.75,20.57 32.07,20.25 U1.20 ; v1(25.15,13.21) 25.15,12.5 R1.1
  Top Layer w0.305: R1.1 28.29,12.11 28.3,12.13
  Bottom Layer w0.203: v1(26.44,19.43) 26.29,19.28 26.29,19.22 26.03,18.97 26.03,14.1 v1(25.15,13.21)
$1N9237: length 5.1
  Top Layer w0.203: U1.73 v1(23.57,34.67) ; C45.2 v1(24.51,37.02)
  Bottom Layer w0.203: v1(23.57,34.67) 23.57,36.08 v1(24.51,37.02)
$1N9314: length 5.6
  Top Layer w0.203: U1.48 40.05,30.65 40.64,31.24 C44.2
$1N9397: length 10.2
  Top Layer w0.203: R34.1 4.19,27.06 4.19,31.5 5.07,32.38 R33.1 5.72,31.88 5.72,30.93 6.43,30.22 U15.9
$1N9401: length 6.4
  Top Layer w0.203: R33.2 C54.1 6.89,33.75 6.89,32.67 6.19,31.97 6.19,30.97 6.43,30.72 U15.8
$1N9402: length 2.3
  Top Layer w0.203: U15.10 6.16,29.72 C55.2
$1N9403: length 11.9
  Top Layer w0.203: R34.2 5.02,27.89 C55.1 5.72,29.46 5.97,29.21 6.88,29.21 U15.11 6.99,29.32 7.44,29.32 8.51,30.38 8.51,30.73 9.04,31.27 9.9,31.27 10.14,31.51 U15.1 10.14,33.55 9.65,34.04 C54.2
$1N9633: length 2.7
  Top Layer w0.203: USB1.4 52.34,10.15 R20.2
$1N9650: length 3.7
  Top Layer w0.2: USB1.10 55.34,8.01 55.59,8.26 56.15,8.26 57,9.11 R19.1
$1N9672: length 2.7
  Top Layer w0.203: C53.1 11.36,29.22 U15.20
$1N9692: length 15.5
  Top Layer w0.203: v1(42.15,26.29) 42.8,26.29 R24.2 ; v1(42.15,27.69) 42.57,27.69 R23.2 42.85,28.39 42.16,29.07 42.16,31.75 41.97,31.95 40.7,31.95 39.99,32.65 39.99,33.54 41.21,34.75 41.21,35.75 42.53,37.07 U9.1
  Bottom Layer w0.203: v1(42.15,26.29) v1(42.15,27.69)
$1N9693: length 7
  Top Layer w0.203: U9.3 42.4,35.07 43.56,33.91 43.56,32.39 43.31,32.13 43.31,32.24 v1(43.36,32.29) ; v1(42.93,30.35) 42.93,29.66 R22.1
  Bottom Layer w0.203: v1(43.36,32.29) 42.93,31.86 v1(42.93,30.35)
$1N9718: length 1.7
  Top Layer w0.203: LED2.1 17.7,10.66 R18.2
$1N9732: length 10.9
  Top Layer w0.203: R13.1 32.51,4.06 32.51,2.7 32.36,2.56 28.85,2.56 28.17,3.23 RST1.1
$1N9740: length 1.8
  Top Layer w0.203: R11.2 39.73,5.91 LED3.1

## Copper pours and planes (outline as drawn; the poured copper is in the pictures)
3.3V on Top Layer: 46.35,7.37 44.83,7.37 44.45,7.75 41.15,7.75 41.15,4.8 34.55,4.8 34.55,2.79 45.65,2.79 46.15,3.3 46.74,3.3 46.74,4.53 44.67,4.53 44.67,5.94 44.96,6.22 46.61,6.22 46.61,7.36 46.36,7.36
3.3V on 电源: 0.26,39.62 58.93,39.62 58.93,0.26 0.26,0.26
+5V on Inner1: 10.79,13.84 6.04,13.84 4.11,11.92 4.11,2.53 21.07,2.53 24.25,5.72 40.77,5.72 40.77,7.24 41.4,7.87 50.32,7.87 51.18,7.02 51.18,5.97 51.56,5.59 55.63,5.59 56.39,6.35 56.39,8.13 51.94,8.13 48.26,11.81 40.77,11.81 36.45,7.49 8,7.49 6.48,9.02 6.48,12.06 6.6,12.19 10.79,12.19 10.79,12.19
GND on Top Layer: -0.13,39.88 59.06,39.88 59.06,0.25 -0.13,0.25
GND on Bottom Layer: 0.13,39.88 59.06,39.88 59.06,0.25 0.13,0.25
GND on Inner1: 0.13,40 59.06,40 59.06,0 0.13,0

Small or netless copper shapes (teardrops, artwork), in the pictures only: 24 on Top Layer, 6 on Bottom Layer

## Text on the board
Bottom Silkscreen Layer: PC5 -> BLK / PA4 -> DC / PA6 -> CS / PA5 -> SCL / PA7 -> SDA / PC4 -> RES | AT24XX / PA8 -> SCL / PC9 -> SDA / MPU6050 / PB11 -> SDA / PB10 -> SCL / PE15 -> INT
Top Silkscreen Layer: 3.3V SDA SCL GND RX TX | PC7 PC6 | PE8 PE7 | 5V PA2 PA3 GND
